# Altium schematic sheet ASSB_VarBuck.SchDoc
size A4
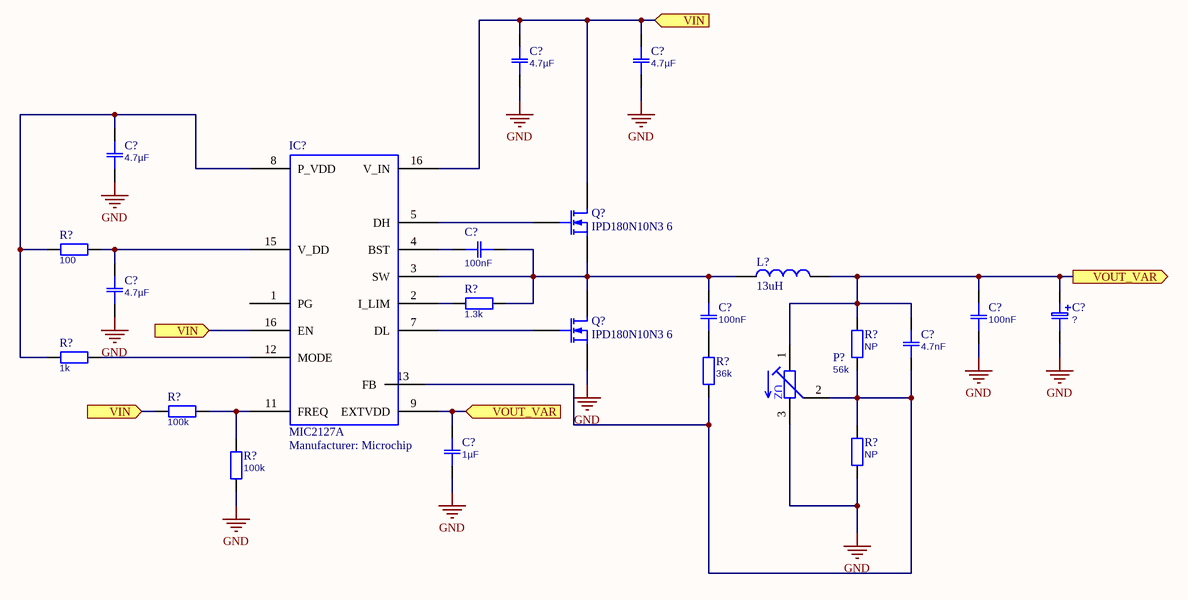
[diagram p0: ASSB_VarBuck.SchDoc]

## Parts
(Parts that share a designator on the sheet are numbered #1, #2 ... from top to bottom, then left to right.)
C?#1  4.7µF  [0603]
C?#2  4.7µF  [0603]
C?#3  4.7µF  [0603]
C?#4  100nF  [0603]
C?#5  4.7µF  [0603]
C?#6  100nF  [0603]
C?#7  100nF  [0603]
C?#8  ?  [SMELK-A]
C?#9  4.7nF  [0603]
C?#10  1µF  [0603]
IC?  MIC2127A  Manufacturer: Microchip  [QFN-MG16_M]
L?  value 13uH  [WE-HCI_1365_WE-PERM]  (hidden comment: 7443551131)
P?  56k  [Model 43 Trimmer]
Q?#1  IPD180N10N3 6  [E3]
Q?#2  IPD180N10N3 6  [E3]
R?#1  100  [0603]
R?#2  1.3k  [0603]
R?#3  1k  [0603]
R?#4  NP  [0603]
R?#5  36k  [0603]
R?#6  100k  [0603]
R?#7  NP  [0603]
R?#8  100k  [0603]

## Ports
VIN (in), VOUT_VAR (in), VOUT_VAR (out)

## Nets
GND: C?#1.1 C?#2.1 C?#3.2 C?#5.2 C?#7.2 C?#8.2(-) C?#10.2 P?.3 Q?#2.3(S) R?#7.1 R?#8.1
VIN: C?#1.2 C?#2.2 IC?.16(EN) Q?#1.1(D) R?#6.1 ; port VIN
VOUT_VAR: C?#7.1 C?#8.1(+) C?#9.1 C?#10.1 IC?.9(EXTVDD) L?.2 P?.1 R?#4.2 ; port VOUT_VAR
NetC?#3_1: C?#3.1 IC?.8(P_VDD) R?#1.1 R?#3.1
NetC?#4_1: C?#4.1 C?#6.1 IC?.3(SW) L?.1 Q?#1.3(S) Q?#2.1(D) R?#2.2
NetC?#4_2: C?#4.2 IC?.4(BST)
NetC?#5_1: C?#5.1 IC?.15(V_DD) R?#1.2
NetC?#6_2: C?#6.2 R?#5.2
NetC?#9_2: C?#9.2 IC?.13(FB) P?.2 R?#4.1 R?#5.1 R?#7.2
NetIC?_2: IC?.2(I_LIM) R?#2.1
NetIC?_5: IC?.5(DH) Q?#1.2(G)
NetIC?_7: IC?.7(DL) Q?#2.2(G)
NetIC?_11: IC?.11(FREQ) R?#6.2 R?#8.2
NetIC?_12: IC?.12(MODE) R?#3.2

Not connected (* = marked no-connect by the designer): IC? 1(PG)

## Notes on the sheet
- (in symbol Potentiometer) UZ

## Library data of the parts
C?#1-C?#7 C?#9 C?#10 = Capacitor: Partnumber: ?; Value: ?
C?#8 = Capacitor polarised: Capacitor, polarised; Partnumber: ?; Value: ?
IC? = MIC2127A: 75V, Synchronous Buck Controller Featuring ADaptive On-Time Control
L? = 7443551131: WE-HCI SMD Flat Wire High Current Inductor, size 1365, 10A, 13uH; Material: WE-PERM; ComponentLink1Description: Manufacturer; ComponentLink1URL: http://www.we-online.de; ComponentLink2Description: Datasheet; ComponentLink2URL: http://katalog.we-online.de/pbs/datasheet/7443551131.pdf; Part Number: 7443551131; Published Date: July 2017; Publisher: Wurth Elektronik; Rated Current: 10A; Size: 1365
P? = Potentiometer: Partnumber: ?; Value: ?
Q?#1 Q?#2 = MOSFET-N: N-Channel MOSFET; Published: 8-Jun-2000; LatestRevisionDate: 17-Jul-2002; LatestRevisionNote: Re-released for DXP Platform.; PackageVersion: 1995/1996; PackageReference: E3; Publisher: Altium Limited; PackageDescription: TO, Flat Index; 3 In-Line, Axial Leads; Body Dia. 4.6mm; Lead Dia. 0.5 mm (max)
R?#1-R?#8 = Resistor: Partnumber: ?; Value: ?